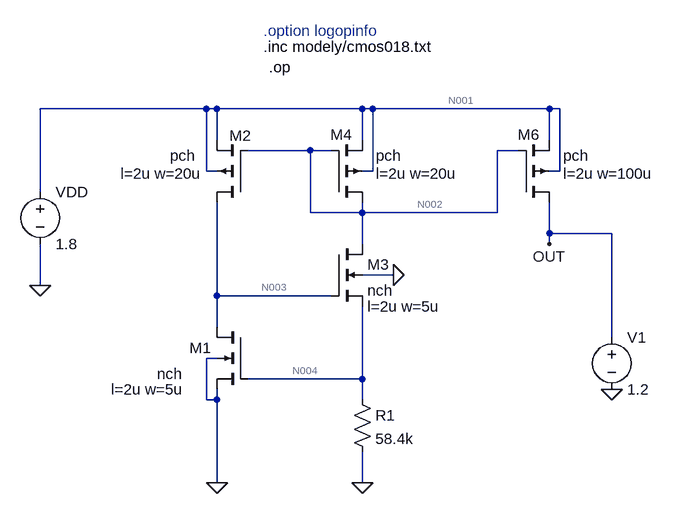
[diagram p0: schematic 1_IREF.asc]
1_IREF.asc, the LTspice schematic file:
Version 4
SHEET 1 1368 1252
WIRE -864 144 -1120 144
WIRE -848 144 -864 144
WIRE -624 144 -848 144
WIRE -608 144 -624 144
WIRE -336 144 -608 144
WIRE -320 144 -336 144
WIRE -848 192 -848 144
WIRE -624 192 -624 144
WIRE -336 192 -336 144
WIRE -704 208 -800 208
WIRE -672 208 -704 208
WIRE -384 208 -416 208
WIRE -864 240 -864 144
WIRE -848 240 -864 240
WIRE -608 240 -608 144
WIRE -608 240 -624 240
WIRE -320 240 -320 144
WIRE -320 240 -336 240
WIRE -1120 272 -1120 144
WIRE -704 304 -704 208
WIRE -624 304 -624 288
WIRE -624 304 -704 304
WIRE -416 304 -416 208
WIRE -416 304 -624 304
WIRE -336 336 -336 288
WIRE -240 336 -336 336
WIRE -624 352 -624 304
WIRE -336 352 -336 336
WIRE -576 400 -624 400
WIRE -1120 416 -1120 352
WIRE -848 432 -848 288
WIRE -672 432 -848 432
WIRE -848 480 -848 432
WIRE -240 496 -240 336
WIRE -848 528 -864 528
WIRE -624 560 -624 448
WIRE -624 560 -800 560
WIRE -864 592 -864 528
WIRE -848 592 -848 576
WIRE -848 592 -864 592
WIRE -624 592 -624 560
WIRE -848 720 -848 592
WIRE -624 720 -624 672
FLAG -1120 416 0
FLAG -624 720 0
FLAG -848 720 0
FLAG -576 400 0
FLAG -336 352 OUT
FLAG -240 576 0
DATAFLAG -736 208 "round($*1e4)/1e4"
DATAFLAG -752 432 "round($*1e4)/1e4"
DATAFLAG -688 560 "round($*1e4)/1e4"
DATAFLAG -864 144 "round(Is(M2)*10e6)/10e6"
DATAFLAG -640 144 "round(Is(M4)*10e6)/10e6"
DATAFLAG -336 144 "round(Is(M6)*10e6)/10e6"
SYMBOL nmos4 -672 352 R0
WINDOW 123 56 96 Left 2
SYMATTR Value2 l=2u w=5u
SYMATTR InstName M3
SYMATTR Value nch
SYMBOL voltage -1120 256 R0
SYMATTR InstName VDD
SYMATTR Value 1.8
SYMBOL nmos4 -800 480 M0
WINDOW 123 99 96 Left 2
WINDOW 3 101 72 Left 2
SYMATTR Value2 l=2u w=5u
SYMATTR Value nch
SYMATTR InstName M1
SYMBOL res -640 576 R0
SYMATTR InstName R1
SYMATTR Value 58.4k
SYMBOL pmos4 -800 288 R180
WINDOW 0 -5 103 Left 2
WINDOW 3 81 72 Left 2
WINDOW 123 71 44 Left 2
SYMATTR InstName M2
SYMATTR Value pch
SYMATTR Value2 l=2u w=20u
SYMBOL pmos4 -672 288 M180
WINDOW 0 -1 104 Left 2
WINDOW 3 69 72 Left 2
WINDOW 123 69 44 Left 2
SYMATTR InstName M4
SYMATTR Value pch
SYMATTR Value2 l=2u w=20u
SYMBOL pmos4 -384 288 M180
WINDOW 0 -1 104 Left 2
WINDOW 3 69 72 Left 2
WINDOW 123 69 44 Left 2
SYMATTR InstName M6
SYMATTR Value pch
SYMATTR Value2 l=2u w=100u
SYMBOL voltage -240 480 R0
WINDOW 123 0 0 Left 0
WINDOW 39 0 0 Left 0
SYMATTR InstName V1
SYMATTR Value 1.2
TEXT -776 48 Left 2 !.inc modely/cmos018.txt
TEXT -768 80 Left 2 !.op
TEXT -776 24 Left 2 ;.option logopinfo

The netlist it stands for:
* 1_IREF.asc
M3 N002 N003 N004 0 nch l=2u w=5u
VDD N001 0 1.8
M1 N003 N004 0 0 nch l=2u w=5u
R1 N004 0 58.4k
M2 N003 N002 N001 N001 pch l=2u w=20u
M4 N002 N002 N001 N001 pch l=2u w=20u
M6 OUT N002 N001 N001 pch l=2u w=100u
V1 OUT 0 1.2
.model NMOS NMOS
.model PMOS PMOS
.lib standard.mos
.inc modely/cmos018.txt
.op
* .option logopinfo
.backanno
.end

* Results of the author's LTspice run, read from the files saved beside the schematic
* Operating Point:
*   V(n002) = 1.212 V
*   V(n003) = 1.301 V
*   V(n004) = 575.5 mV
*   V(n001) = 1.8 V
*   V(out) = 1.2 V
*   Id(M3) = 9.854 µA
*   Ig(M3) = 0 A
*   Ib(M3) = -1.807 pA
*   Is(M3) = -9.854 µA
*   Id(M1) = 9.781 µA
*   Ig(M1) = 0 A
*   Ib(M1) = -1.311 pA
*   Is(M1) = -9.781 µA
*   Id(M2) = -9.781 µA
*   Ig(M2) = 0 A
*   Ib(M2) = 509.4 fA
*   Is(M2) = 9.781 µA
*   Id(M4) = -9.854 µA
*   Ig(M4) = 0 A
*   Ib(M4) = 598.2 fA
*   Is(M4) = 9.854 µA
*   Id(M6) = -49.48 µA
*   Ig(M6) = 0 A
*   Ib(M6) = 610 fA
*   Is(M6) = 49.48 µA
*   I(R1) = 9.854 µA
*   I(Vdd) = -69.11 µA
*   I(V1) = 49.48 µA
* From the log:
*   Semiconductor Device Operating Points:
*                           --- BSIM3 MOSFETS ---
*   Name:        m3          m1          m2          m4          m6
*   Model:       nch         nch         pch         pch         pch
*   Id:        9.85e-06    9.78e-06   -9.78e-06   -9.85e-06   -4.95e-05
*   Vgs:       7.25e-01    5.75e-01   -5.88e-01   -5.88e-01   -5.88e-01
*   Vds:       6.36e-01    1.30e+00   -4.99e-01   -5.88e-01   -6.00e-01
*   Vbs:      -5.75e-01    0.00e+00    0.00e+00    0.00e+00    0.00e+00
*   Vth:       5.44e-01    3.80e-01   -4.05e-01   -4.04e-01   -4.04e-01
*   Vdsat:     1.59e-01    1.52e-01   -1.56e-01   -1.56e-01   -1.57e-01
*   Gm:        1.06e-04    1.04e-04    9.92e-05    9.98e-05    5.01e-04
*   Gds:       2.08e-07    4.54e-07    8.41e-07    8.24e-07    4.12e-06
*   Gmb        2.43e-05    1.48e-04    3.14e-05    3.16e-05    1.60e-04
*   Cbd:       0.00e+00    0.00e+00    0.00e+00    0.00e+00    0.00e+00
*   Cbs:       0.00e+00    0.00e+00    0.00e+00    0.00e+00    0.00e+00
*   Cgsov:     3.50e-15    3.50e-15    1.37e-14    1.37e-14    6.85e-14
*   Cgdov:     3.48e-15    3.48e-15    1.38e-14    1.38e-14    6.88e-14
*   Cgbov:     1.98e-18    1.98e-18    1.96e-18    1.96e-18    1.96e-18
*   dQgdVgb:   7.33e-14    7.51e-14    2.95e-13    2.94e-13    1.47e-12
*   dQgdVdb:  -3.51e-15   -3.35e-15   -1.34e-14   -1.33e-14   -6.66e-14
*   dQgdVsb:  -6.60e-14   -1.23e-13   -2.69e-13   -2.69e-13   -1.34e-12
*   dQddVgb:  -3.11e-14   -3.10e-14   -1.23e-13   -1.23e-13   -6.16e-13
*   dQddVdb:   3.50e-15    3.40e-15    1.36e-14    1.35e-14    6.77e-14
*   dQddVsb:   3.44e-14    6.87e-14    1.45e-13    1.45e-13    7.26e-13
*   dQbdVgb:  -1.12e-14   -1.30e-14   -4.80e-14   -4.81e-14   -2.39e-13
*   dQbdVdb:  -1.76e-17    1.87e-17   -8.58e-17   -1.30e-17   -2.80e-17
*   dQbdVsb:  -6.26e-15   -1.76e-14   -3.54e-14   -3.53e-14   -1.79e-13